# Altium project CurrentSensor.PrjPcb
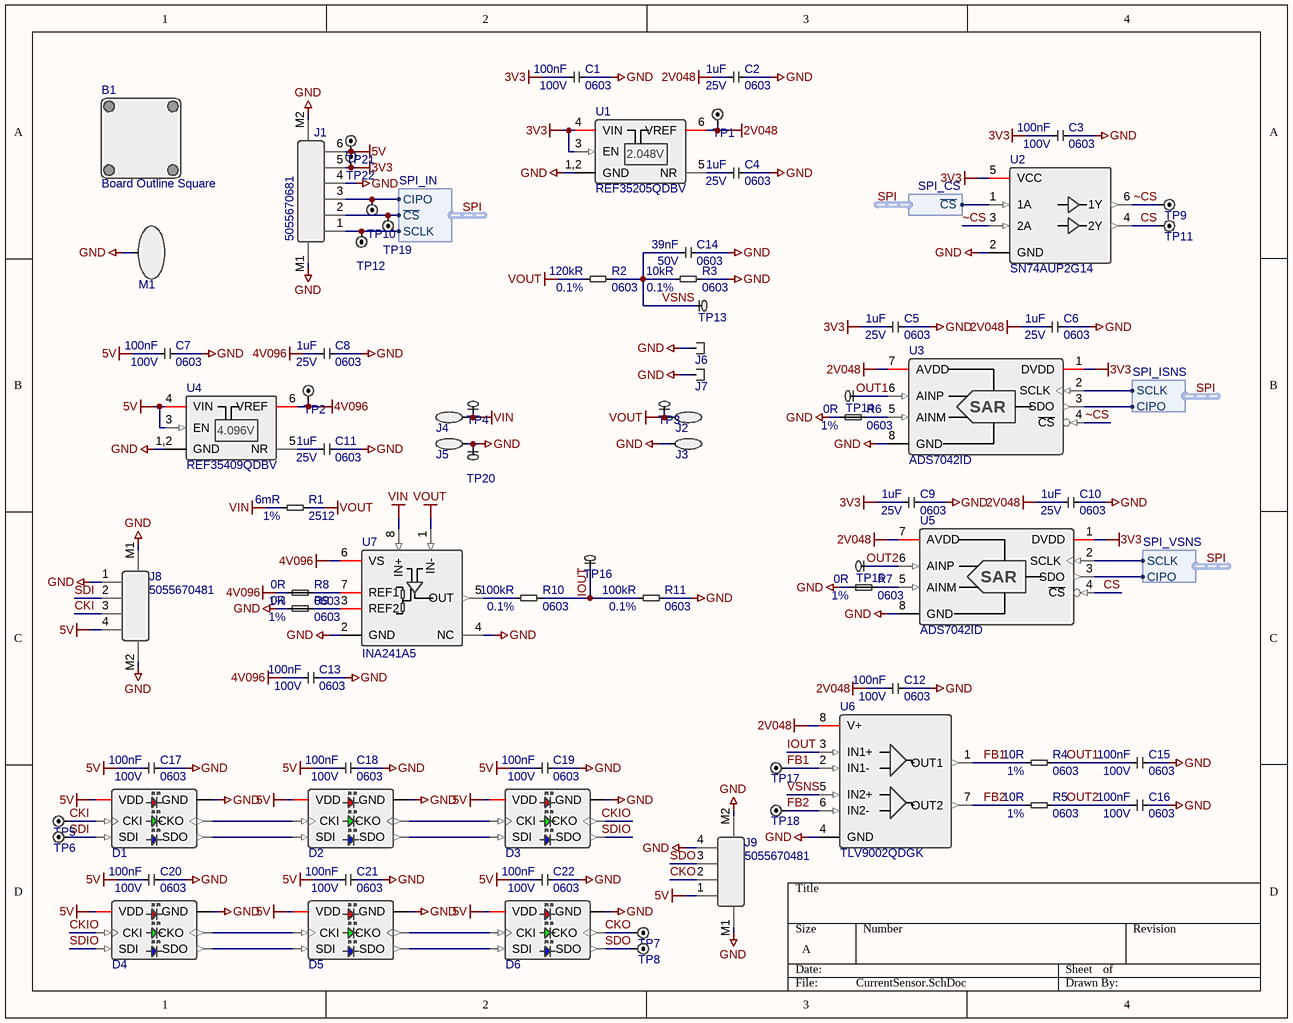
[diagram p0: CurrentSensor.SchDoc]
1 sheet, 79 parts. Net scope: global (net labels, ports and power ports of the same name join across sheets).
Board file: CurrentSensor.PcbDoc

## Sheet CurrentSensor.SchDoc
size A; SheetNumber: 1; SheetTotal: 1

### Parts
B1  Board Outline Square  [PCB_OUTLINE_SQUARE]
C1  value 100nF  Voltage - Rated: 100V  Package/Case Imperial: 0603  [CAPACITOR_0603(1608)_GENERIC]  (hidden comment: Capacitor - Ceramic - Generic)
C2  value 1uF  Voltage - Rated: 25V  Package/Case Imperial: 0603  [CAPACITOR_0603(1608)_GENERIC]  (hidden comment: Capacitor - Ceramic - Generic)
C3  value 100nF  Voltage - Rated: 100V  Package/Case Imperial: 0603  [CAPACITOR_0603(1608)_GENERIC]  (hidden comment: Capacitor - Ceramic - Generic)
C4  value 1uF  Voltage - Rated: 25V  Package/Case Imperial: 0603  [CAPACITOR_0603(1608)_GENERIC]  (hidden comment: Capacitor - Ceramic - Generic)
C5  value 1uF  Voltage - Rated: 25V  Package/Case Imperial: 0603  [CAPACITOR_0603(1608)_GENERIC]  (hidden comment: Capacitor - Ceramic - Generic)
C6  value 1uF  Voltage - Rated: 25V  Package/Case Imperial: 0603  [CAPACITOR_0603(1608)_GENERIC]  (hidden comment: Capacitor - Ceramic - Generic)
C7  value 100nF  Voltage - Rated: 100V  Package/Case Imperial: 0603  [CAPACITOR_0603(1608)_GENERIC]  (hidden comment: Capacitor - Ceramic - Generic)
C8  value 1uF  Voltage - Rated: 25V  Package/Case Imperial: 0603  [CAPACITOR_0603(1608)_GENERIC]  (hidden comment: Capacitor - Ceramic - Generic)
C9  value 1uF  Voltage - Rated: 25V  Package/Case Imperial: 0603  [CAPACITOR_0603(1608)_GENERIC]  (hidden comment: Capacitor - Ceramic - Generic)
C10  value 1uF  Voltage - Rated: 25V  Package/Case Imperial: 0603  [CAPACITOR_0603(1608)_GENERIC]  (hidden comment: Capacitor - Ceramic - Generic)
C11  value 1uF  Voltage - Rated: 25V  Package/Case Imperial: 0603  [CAPACITOR_0603(1608)_GENERIC]  (hidden comment: Capacitor - Ceramic - Generic)
C12  value 100nF  Voltage - Rated: 100V  Package/Case Imperial: 0603  [CAPACITOR_0603(1608)_GENERIC]  (hidden comment: Capacitor - Ceramic - Generic)
C13  value 100nF  Voltage - Rated: 100V  Package/Case Imperial: 0603  [CAPACITOR_0603(1608)_GENERIC]  (hidden comment: Capacitor - Ceramic - Generic)
C14  value 39nF  Voltage - Rated: 50V  Package/Case Imperial: 0603  [CAPACITOR_0603(1608)_GENERIC]  (hidden comment: Capacitor - Ceramic - Generic)
C15  value 100nF  Voltage - Rated: 100V  Package/Case Imperial: 0603  [CAPACITOR_0603(1608)_GENERIC]  (hidden comment: Capacitor - Ceramic - Generic)
C16  value 100nF  Voltage - Rated: 100V  Package/Case Imperial: 0603  [CAPACITOR_0603(1608)_GENERIC]  (hidden comment: Capacitor - Ceramic - Generic)
C17  value 100nF  Voltage - Rated: 100V  Package/Case Imperial: 0603  [CAPACITOR_0603(1608)_GENERIC]  (hidden comment: Capacitor - Ceramic - Generic)
C18  value 100nF  Voltage - Rated: 100V  Package/Case Imperial: 0603  [CAPACITOR_0603(1608)_GENERIC]  (hidden comment: Capacitor - Ceramic - Generic)
C19  value 100nF  Voltage - Rated: 100V  Package/Case Imperial: 0603  [CAPACITOR_0603(1608)_GENERIC]  (hidden comment: Capacitor - Ceramic - Generic)
C20  value 100nF  Voltage - Rated: 100V  Package/Case Imperial: 0603  [CAPACITOR_0603(1608)_GENERIC]  (hidden comment: Capacitor - Ceramic - Generic)
C21  value 100nF  Voltage - Rated: 100V  Package/Case Imperial: 0603  [CAPACITOR_0603(1608)_GENERIC]  (hidden comment: Capacitor - Ceramic - Generic)
C22  value 100nF  Voltage - Rated: 100V  Package/Case Imperial: 0603  [CAPACITOR_0603(1608)_GENERIC]  (hidden comment: Capacitor - Ceramic - Generic)
D1  APA102C  [5X5MM(6PIN)_JLEAD_GENERIC]  (value not drawn)
D2  APA102C  [5X5MM(6PIN)_JLEAD_GENERIC]  (value not drawn)
D3  APA102C  [5X5MM(6PIN)_JLEAD_GENERIC]  (value not drawn)
D4  APA102C  [5X5MM(6PIN)_JLEAD_GENERIC]  (value not drawn)
D5  APA102C  [5X5MM(6PIN)_JLEAD_GENERIC]  (value not drawn)
D6  APA102C  [5X5MM(6PIN)_JLEAD_GENERIC]  (value not drawn)
J1  Manufacturer Part Number 1: 5055670681  [CONNECTOR_HEADER_MOLEX_5055670681]  (hidden comment: Connector - Header - 6P 2M - Generic)
J2  PP45  [CONNECTOR_BTOC_PP45_ANDERSON]  (value not drawn)
J3  PP45  [CONNECTOR_BTOC_PP45_ANDERSON]  (value not drawn)
J4  PP45  [CONNECTOR_BTOC_PP45_ANDERSON]  (value not drawn)
J5  PP45  [CONNECTOR_BTOC_PP45_ANDERSON]  (value not drawn)
J6  PP45 Staple  [CONNECTOR_ACCESSORY_PP45-STAPLE_ANDERSON]  (value not drawn)
J7  PP45 Staple  [CONNECTOR_ACCESSORY_PP45-STAPLE_ANDERSON]  (value not drawn)
J8  Manufacturer Part Number 1: 5055670481  [CONNECTOR_HEADER_MOLEX_5055670481]  (hidden comment: Connector - Header - 4P 2M - Generic)
J9  Manufacturer Part Number 1: 5055670481  [CONNECTOR_HEADER_MOLEX_5055670481]  (hidden comment: Connector - Header - 4P 2M - Generic)
M1  3670409  [RFSHIELD_WURTH_3670409]  (value not drawn)
R1  value 6mR  Tolerance: 1%  Package/Case Imperial: 2512  [RESISTOR_2512(6432)_GENERIC]  (hidden comment: Resistor - Fixed - Generic)
R2  value 120kR  Tolerance: 0.1%  Package/Case Imperial: 0603  [RESISTOR_0603(1608)_GENERIC]  (hidden comment: Resistor - Fixed - Generic)
R3  value 10kR  Tolerance: 0.1%  Package/Case Imperial: 0603  [RESISTOR_0603(1608)_GENERIC]  (hidden comment: Resistor - Fixed - Generic)
R4  value 10R  Tolerance: 1%  Package/Case Imperial: 0603  [RESISTOR_0603(1608)_GENERIC]  (hidden comment: Resistor - Fixed - Generic)
R5  value 10R  Tolerance: 1%  Package/Case Imperial: 0603  [RESISTOR_0603(1608)_GENERIC]  (hidden comment: Resistor - Fixed - Generic)
R6  value 0R  Tolerance: 1%  Package/Case Imperial: 0603  [RESISTOR_0603(1608)_NC_JUMPER]  (hidden comment: Resistor - Fixed - Jumper)  (net tie, no BOM)
R7  value 0R  Tolerance: 1%  Package/Case Imperial: 0603  [RESISTOR_0603(1608)_NC_JUMPER]  (hidden comment: Resistor - Fixed - Jumper)  (net tie, no BOM)
R8  value 0R  Tolerance: 1%  Package/Case Imperial: 0603  [RESISTOR_0603(1608)_NC_JUMPER]  (hidden comment: Resistor - Fixed - Jumper)  (net tie, no BOM)
R9  value 0R  Tolerance: 1%  Package/Case Imperial: 0603  [RESISTOR_0603(1608)_NC_JUMPER]  (hidden comment: Resistor - Fixed - Jumper)  (net tie, no BOM)
R10  value 100kR  Tolerance: 0.1%  Package/Case Imperial: 0603  [RESISTOR_0603(1608)_GENERIC]  (hidden comment: Resistor - Fixed - Generic)
R11  value 100kR  Tolerance: 0.1%  Package/Case Imperial: 0603  [RESISTOR_0603(1608)_GENERIC]  (hidden comment: Resistor - Fixed - Generic)
TP1  Test Point - THT  [TESTPOINT_THT_OCTAGON]  (value not drawn)
TP2  Test Point - THT  [TESTPOINT_THT_OCTAGON]  (value not drawn)
TP3  519XTR  [TESTPOINT_LOOP_SMD_KEYSTONE_519X]  (value not drawn)
TP4  519XTR  [TESTPOINT_LOOP_SMD_KEYSTONE_519X]  (value not drawn)
TP5  Test Point - THT  [TESTPOINT_THT_OCTAGON]  (value not drawn)
TP6  Test Point - THT  [TESTPOINT_THT_OCTAGON]  (value not drawn)
TP7  Test Point - THT  [TESTPOINT_THT_OCTAGON]  (value not drawn)
TP8  Test Point - THT  [TESTPOINT_THT_OCTAGON]  (value not drawn)
TP9  Test Point - THT  [TESTPOINT_THT_OCTAGON]  (value not drawn)
TP10  Test Point - THT  [TESTPOINT_THT_OCTAGON]  (value not drawn)
TP11  Test Point - THT  [TESTPOINT_THT_OCTAGON]  (value not drawn)
TP12  Test Point - THT  [TESTPOINT_THT_OCTAGON]  (value not drawn)
TP13  519XTR  [TESTPOINT_LOOP_SMD_KEYSTONE_519X]  (value not drawn)
TP14  519XTR  [TESTPOINT_LOOP_SMD_KEYSTONE_519X]  (value not drawn)
TP15  519XTR  [TESTPOINT_LOOP_SMD_KEYSTONE_519X]  (value not drawn)
TP16  519XTR  [TESTPOINT_LOOP_SMD_KEYSTONE_519X]  (value not drawn)
TP17  Test Point - THT  [TESTPOINT_THT_OCTAGON]  (value not drawn)
TP18  Test Point - THT  [TESTPOINT_THT_OCTAGON]  (value not drawn)
TP19  Test Point - THT  [TESTPOINT_THT_OCTAGON]  (value not drawn)
TP20  519XTR  [TESTPOINT_LOOP_SMD_KEYSTONE_519X]  (value not drawn)
TP21  Test Point - THT  [TESTPOINT_THT_OCTAGON]  (value not drawn)
TP22  Test Point - THT  [TESTPOINT_THT_OCTAGON]  (value not drawn)
U1  REF35205QDBV  [SOT23-6(DBV0006A)_TI]
U2  SN74AUP2G14  [SC70-6(DCK0006A)_TI]
U3  ADS7042ID  [VSSOP-8(DCU0008A)_TI]
U4  REF35409QDBV  [SOT23-6(DBV0006A)_TI]
U5  ADS7042ID  [VSSOP-8(DCU0008A)_TI]
U6  TLV9002QDGK  [VSSOP-8(DGK0008A)_TI]
U7  INA241A5  [SOT23-8(DDF0008A)_TI]

### Harnesses
SPI_IN: SCLK, CIPO, ~{CS}
SPI_CS: ~{CS}
SPI_VSNS: SCLK, CIPO
SPI_ISNS: SCLK, CIPO

### Nets
2V048: C2.2 C6.2 C10.2 C12.1 TP1.1 U1.6(VREF) U3.7(AVDD) U5.7(AVDD) U6.8(V+)
3V3: C1.1 C3.1 C5.2 C9.2 J1.5 TP22.1 U1.3(EN) U1.4(VIN) U2.5(VCC) U3.1(DVDD) U5.1(DVDD)
4V096: C8.2 C13.1 R8.1 TP2.1 U4.6(VREF) U7.6(VS)
5V: C7.1 C17.1 C18.1 C19.1 C20.1 C21.1 C22.1 D1.4(VDD) D2.4(VDD) D3.4(VDD) D4.4(VDD) D5.4(VDD) D6.4(VDD) J1.6 J8.4 J9.1 TP21.1 U4.3(EN) U4.4(VIN)
GND: C1.2 C2.1 C3.2 C4.1 C5.1 C6.1 C7.2 C8.1 C9.1 C10.1 C11.1 C12.2 C13.2 C14.2 C15.2 C16.2 C17.2 C18.2 C19.2 C20.2 C21.2 C22.2 D1.3(GND) D2.3(GND) D3.3(GND) D4.3(GND) D5.3(GND) D6.3(GND) J1.4 J1.M1 J1.M2 J3.1 J5.1 J6.1 J7.1 J8.1 J8.M1 J8.M2 J9.4 J9.M1 J9.M2 M1.1 R3.2 R6.1 R7.1 R9.1 R11.2 TP20.1 U1.1,2(GND) U2.2(GND) U3.8(GND) U4.1,2(GND) U5.8(GND) U6.4(GND) U7.2(GND) U7.4(NC)
VIN: J4.1 R1.1 TP4.1 U7.8(IN+)
VOUT: J2.1 R1.2 R2.1 TP3.1 U7.1(IN-)
CKI: D1.2(CKI) J8.3 TP5.1
CKIO: D3.5(CKO) D4.2(CKI)
CKO: D6.5(CKO) J9.2 TP7.1
CS: TP11.1 U2.4(2Y) U5.4(~{CS})
FB1: R4.1 TP17.1 U6.1(OUT1) U6.2(IN1-)
FB2: R5.1 TP18.1 U6.6(IN2-) U6.7(OUT2)
IOUT: R10.2 R11.1 TP16.1 U6.3(IN1+)
OUT1: C15.1 R4.2 TP14.1 U3.6(AINP)
OUT2: C16.1 R5.2 TP15.1 U5.6(AINP)
SDI: D1.1(SDI) J8.2 TP6.1
SDIO: D3.6(SDO) D4.1(SDI)
SDO: D6.6(SDO) J9.3 TP8.1
SPI.~{CS}: J1.2 TP19.1 U2.1(1A) ; harness SPI_IN.~{CS}, harness SPI_CS.~{CS}
SPI.CIPO: J1.3 TP10.1 U3.3(SDO) U5.3(SDO) ; harness SPI_IN.CIPO, harness SPI_VSNS.CIPO, harness SPI_ISNS.CIPO
SPI.SCLK: J1.1 TP12.1 U3.2(SCLK) U5.2(SCLK) ; harness SPI_IN.SCLK, harness SPI_VSNS.SCLK, harness SPI_ISNS.SCLK
VSNS: C14.1 R2.2 R3.1 TP13.1 U6.5(IN2+)
~CS: TP9.1 U2.3(2A) U2.6(1Y) U3.4(~{CS})
NetC4_2: C4.2 U1.5(NR)
NetC11_2: C11.2 U4.5(NR)
NetD1_5: D1.5(CKO) D2.2(CKI)
NetD1_6: D1.6(SDO) D2.1(SDI)
NetD2_5: D2.5(CKO) D3.2(CKI)
NetD2_6: D2.6(SDO) D3.1(SDI)
NetD4_5: D4.5(CKO) D5.2(CKI)
NetD4_6: D4.6(SDO) D5.1(SDI)
NetD5_5: D5.5(CKO) D6.2(CKI)
NetD5_6: D5.6(SDO) D6.1(SDI)
NetR6_2: R6.2 U3.5(AINM)
NetR7_2: R7.2 U5.5(AINM)
NetR8_2: R8.2 U7.7(REF1)
NetR9_2: R9.2 U7.3(REF2)
NetR10_1: R10.1 U7.5(OUT)

### Notes on the sheet
- (in symbol IC - Data Acquisition - ADC - TI ADS7042ID) SAR
- (in symbol IC - Power Management - Voltage Reference - TI REF35205) 2.048V
- (in symbol IC - Power Management - Voltage Reference - TI REF35409) 4.096V

### Library data of the parts
B1 = Board_Outline_Square
C1 C3 C7 C12 C13 C15-C22 = CAP-CER_100NF_100V_20%_X7R_0603(1608): 100nF ±20% 100V Ceramic Capacitor X7R 0603(1608 Metric); Manufacturer 1: Murata Electronics; Manufacturer Part Number 1: GRM188R72A104KA35D; Manufacturer Lifecycle 1: Active; Package/Case Metric: 1608; Name: CAP-CER_100NF_100V_20%_X7R_0603(1608); Item: CAP-CER; Temperature Coefficient: X7R; Tolerance: 20%; Mounting Type: SMT; Full Item: Ceramic Capacitor; Manufacturer 2: Murata Electronics; Manufacturer Part Number 2: GRM188R72A104KA35J; Manufacturer Lifecycle 2: Active; Manufacturer 3: Murata Electronics; Manufacturer Part Number 3: GRM188R72A104MA35D; Manufacturer Lifecycle 3: Active
C2 C4-C6 C8-C11 = CAP-CER_1UF_25V_20%_X7R_0603(1608): 1uF ±20% 25V Ceramic Capacitor X7R 0603(1608 Metric); Manufacturer 1: Murata Electronics; Manufacturer Part Number 1: GCM188R71E105KA64D; Manufacturer Lifecycle 1: Active; Package/Case Metric: 1608; Name: CAP-CER_1UF_25V_20%_X7R_0603(1608); Item: CAP-CER; Temperature Coefficient: X7R; Tolerance: 20%; Mounting Type: SMT; Full Item: Ceramic Capacitor; Manufacturer 2: Murata Electronics; Manufacturer Part Number 2: GCM188R71E105KA64J; Manufacturer Lifecycle 2: Active; Manufacturer 3: Murata Electronics; Manufacturer Part Number 3: GCM188R71E105MA64D; Manufacturer Lifecycle 3: Active
C14 = CAP-CER_39NF_50V_10%_X8L_0603(1608): 39nF ±10% 50V Ceramic Capacitor X8L 0603(1608 Metric); Manufacturer 1: Murata Electronics; Manufacturer Part Number 1: GCM188L81H393KA55D; Manufacturer Lifecycle 1: Active; Package/Case Metric: 1608; Name: CAP-CER_39NF_50V_10%_X8L_0603(1608); Item: CAP-CER; Temperature Coefficient: X8L; Tolerance: 10%; Mounting Type: SMT; Full Item: Ceramic Capacitor
D1-D6 = Diode - LED - Addressable - 5x5mm APA102C: Supplier 1: Digi-Key; Supplier Part Number 1: 1568-COM-16345-ND; Supplier 2: Mouser; Supplier Part Number 2: 474-COM-16345
J1 = CON_HDR_6P_1.25MM-PITCH_50V_2.4A_SMT_MOLEX_5055670681: Connector Header 6 Pin 1.25mm Pitch Mating 50V 2.4A Rated 8 Walls Shrouded SMT Molex 5055670681; Manufacturer Lifecycle 1: Active; Number of Positions: 6; Shrouding: 8 Walls; Name: CON_HDR_6P_1.25MM-PITCH_50V_2.4A_SMT_MOLEX_5055670681; Item: CON_HDR; Pitch - Mating: 1.25mm; Fastening Type: Locking Ramp; Voltage - Max: 50V; Current - Max: 2.4A; Mounting Type: SMT; Full Item: Connector Header; Manufacturer 1: Molex
J2-J5 = Connector - Modular - 1P - Anderson PP45
J6 J7 = Connector - Accessory - Mechanical Support - Anderson PP45 Staple
J8 J9 = CON_HDR_4P_1.25MM-PITCH_50V_2.4A_SMT_MOLEX_5055670481: Connector Header 4 Pin 1.25mm Pitch Mating 50V 2.4A Rated 6 Walls Shrouded SMT Molex 5055670481; Manufacturer Lifecycle 1: Active; Number of Positions: 4; Shrouding: 6 Walls; Name: CON_HDR_4P_1.25MM-PITCH_50V_2.4A_SMT_MOLEX_5055670481; Item: CON_HDR; Pitch - Mating: 1.25mm; Fastening Type: Locking Ramp; Voltage - Max: 50V; Current - Max: 2.4A; Mounting Type: SMT; Full Item: Connector Header; Manufacturer 1: Molex
M1 = RF-Shield - Cage - Wurth 3670409: Supplier 1: Digi-Key; Supplier Part Number 1: 732-3670409-ND; Supplier 2: Mouser; Supplier Part Number 2: 710-3670409
R1 = RES-FXD_6MR_1%_2W_50PPM/°C_2512(6432): 6mR ±1% 2W Chip Resistor 50ppm/°C 2512(6432 Metric); Manufacturer 1: Bourns Inc.; Manufacturer Part Number 1: CRE2512-FZ-R006E-3; Manufacturer Lifecycle 1: Active; Package/Case Metric: 6432; Name: RES-FXD_6MR_1%_2W_50PPM/°C_2512(6432); Item: RES-FXD; Temperature Coefficient: 50ppm/°C; Power: 2W; Mounting Type: SMT; Full Item: Chip Resistor; Manufacturer 2: Bourns Inc.; Manufacturer Part Number 2: CRF2512-FZ-R006ELF; Manufacturer Lifecycle 2: Active
R2 = RES-FXD_120KR_0.1%_100MW_25PPM/°C_0603(1608): 120kR ±0.1% 100mW Chip Resistor 25ppm/°C 0603(1608 Metric); Manufacturer 1: Panasonic; Manufacturer Part Number 1: ERA-3AEB124V; Manufacturer Lifecycle 1: Active; Package/Case Metric: 1608; Name: RES-FXD_120KR_0.1%_100MW_25PPM/°C_0603(1608); Item: RES-FXD; Temperature Coefficient: 25ppm/°C; Power: 100mW; Mounting Type: SMT; Full Item: Chip Resistor
R3 = RES-FXD_10KR_0.1%_100MW_15PPM/°C_0603(1608): 10kR ±0.1% 100mW Chip Resistor 15ppm/°C 0603(1608 Metric); Manufacturer 1: Panasonic; Manufacturer Part Number 1: ERA-3ARB103V; Manufacturer Lifecycle 1: Active; Package/Case Metric: 1608; Name: RES-FXD_10KR_0.1%_100MW_15PPM/°C_0603(1608); Item: RES-FXD; Temperature Coefficient: 15ppm/°C; Power: 100mW; Mounting Type: SMT; Full Item: Chip Resistor; Manufacturer 2: Panasonic; Manufacturer Part Number 2: ERA-3APB103V; Manufacturer Lifecycle 2: Active
R4 R5 = RES-FXD_10R_1%_100MW_100PPM/°C_0603(1608): 10R ±1% 100mW Chip Resistor 100ppm/°C 0603(1608 Metric); Manufacturer 1: Bourns Inc.; Manufacturer Part Number 1: CR0603-FX-10R0ELF; Manufacturer Lifecycle 1: Active; Package/Case Metric: 1608; Name: RES-FXD_10R_1%_100MW_100PPM/°C_0603(1608); Item: RES-FXD; Temperature Coefficient: 100ppm/°C; Power: 100mW; Mounting Type: SMT; Full Item: Chip Resistor; Manufacturer 2: Bourns Inc.; Manufacturer Part Number 2: CR0603AFX-10R0EAS; Manufacturer Lifecycle 2: Active; Manufacturer 3: Bourns Inc.; Manufacturer Part Number 3: CMP0603AFX-10R0ELF; Manufacturer Lifecycle 3: Active
R6-R9 = RES-JMP_0R_1%_100MW_100PPM/°C_0603(1608): 0R ±1% 100mW Chip Resistor with Jumper 100ppm/°C 0603(1608 Metric); Package/Case Metric: 1608; Name: RES-JMP_0R_1%_100MW_100PPM/°C_0603(1608); Item: RES-JMP; Temperature Coefficient: 100ppm/°C; Power: 100mW; Mounting Type: SMT; Full Item: Chip Resistor with Jumper
R10 R11 = RES-FXD_100KR_0.1%_100MW_10PPM/°C_0603(1608): 100kR ±0.1% 100mW Chip Resistor 10ppm/°C 0603(1608 Metric); Manufacturer 1: Panasonic; Manufacturer Part Number 1: ERA-3ARB104V; Manufacturer Lifecycle 1: Active; Package/Case Metric: 1608; Name: RES-FXD_100KR_0.1%_100MW_10PPM/°C_0603(1608); Item: RES-FXD; Temperature Coefficient: 10ppm/°C; Power: 100mW; Mounting Type: SMT; Full Item: Chip Resistor
TP3 TP4 TP13-TP16 TP20 = Test Point - SMT - Loop - Keystone 519X
U1 = IC - Power Management - Voltage Reference - TI REF35205: Supplier 1: Texas Instruments; Supplier Part Number 1: REF35205QDBVR; Supplier 2: Digi-Key; Supplier Part Number 2: 296-REF35205QDBVRCT-ND; Supplier 3: Digi-Key; Supplier Part Number 3: 296-REF35205QDBVRDKR-ND; Supplier 4: Mouser; Supplier Part Number 4: 595-REF35205QDBVR
U2 = IC - Logic - Inverter - TI SN74AUP2G14: Supplier 1: Mouser; Supplier Part Number 1: 595-SN74AUP2G14DCKR; Supplier 2: Texas Instruments; Supplier Part Number 2: SN74AUP2G14DCKR; Supplier 3: Digi-Key; Supplier Part Number 3: 296-27361-1-ND; Supplier 4: Digi-Key; Supplier Part Number 4: 296-27361-6-ND
U3 U5 = IC - Data Acquisition - ADC - TI ADS7042ID: Supplier 1: Mouser; Supplier Part Number 1: 595-ADS7042IDCUR; Supplier 2: Digi-Key; Supplier Part Number 2: 296-38532-1-ND; Supplier 3: Digi-Key; Supplier Part Number 3: 296-38532-6-ND; Supplier 4: Digi-Key; Supplier Part Number 4: 296-38532-2-ND; Supplier 5: Mouser; Supplier Part Number 5: 595-ADS7042IDCUT; Supplier 6: Arrow Electronics; Supplier Part Number 6: ADS7042IDCUT; Supplier 7: Digi-Key; Supplier Part Number 7: 296-38551-1-ND; Supplier 8: Digi-Key; Supplier Part Number 8: 296-38551-6-ND; Supplier 9: Digi-Key; Supplier Part Number 9: 296-38551-2-ND
U4 = IC - Power Management - Voltage Reference - TI REF35409: Supplier 1: Texas Instruments; Supplier Part Number 1: REF35409QDBVR; Supplier 2: Digi-Key; Supplier Part Number 2: 296-REF35409QDBVRCT-ND; Supplier 3: Digi-Key; Supplier Part Number 3: 296-REF35409QDBVRDKR-ND; Supplier 4: Mouser; Supplier Part Number 4: 595-REF35409QDBVR
U6 = IC - Amplifier - Op Amp - TI TLV9002QDGK: Supplier 1: Mouser; Supplier Part Number 1: 595-TLV9002QDGKRQ1; Supplier 2: Texas Instruments; Supplier Part Number 2: TLV9002QDGKRQ1; Supplier 3: Digi-Key; Supplier Part Number 3: 296-TLV9002QDGKRQ1CT-ND; Supplier 4: Digi-Key; Supplier Part Number 4: 296-TLV9002QDGKRQ1DKR-ND
U7 = IC - Amplifier - Current Sense - TI INA241A5: Supplier 1: Texas Instruments; Supplier Part Number 1: INA241A5IDDFR; Supplier 2: Digi-Key; Supplier Part Number 2: 296-INA241A5IDDFRDKR-ND; Supplier 3: Digi-Key; Supplier Part Number 3: 296-INA241A5IDDFRCT-ND; Supplier 4: Mouser; Supplier Part Number 4: 595-INA241A5IDDFR